# EAGLE schematic EMG (EAGLE 9.3.1)

## Sheet 1 of 2
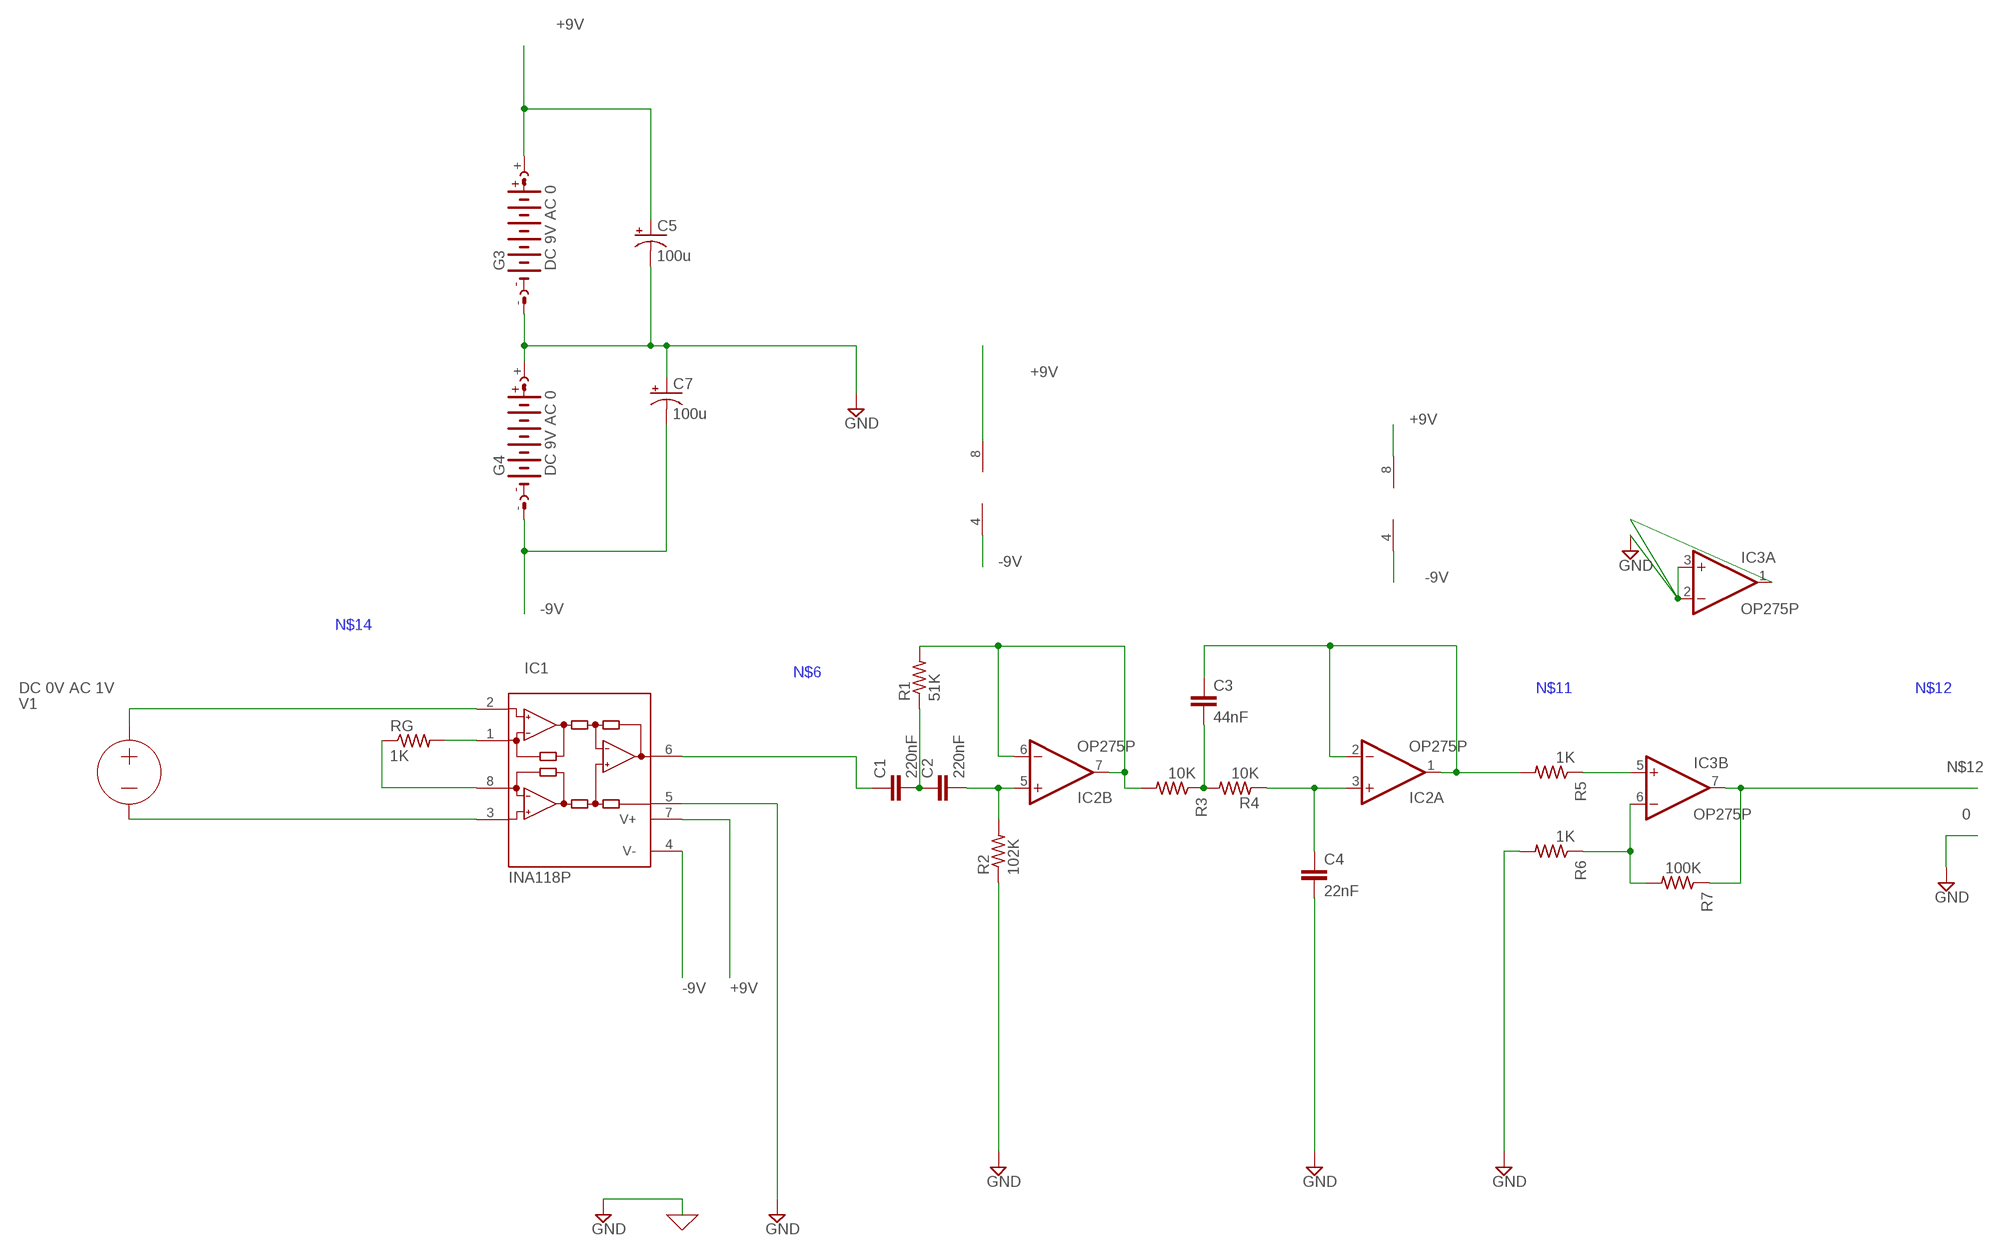
[diagram p0: schematic, sheet 1]

### Parts
C1  220nF  C-EU050-035X075  [C050-035X075]
C2  220nF  C-EU050-035X075  [C050-035X075]
C3  44nF  C-EU050-035X075  [C050-035X075]
C4  22nF  C-EU050-035X075  [C050-035X075]
C5  100u  CPOL-USE2.5-6  [E2,5-6]
C7  100u  CPOL-USE2.5-6  [E2,5-6]
G3  DC 9V AC 0  AB9V  [AB9V]
G4  DC 9V AC 0  AB9V  [AB9V]
IC1  INA118P  [DIL08]
IC2  OP275P  [DIL08]
IC3  OP275P  [DIL08]
R1  51K  R-US_0207/7  [0207/7]
R2  102K  R-US_0207/7  [0207/7]
R3  10K  R-US_0207/7  [0207/7]
R4  10K  R-US_0207/7  [0207/7]
R5  1K  R-US_0207/7  [0207/7]
R6  1K  R-US_0207/7  [0207/7]
R7  100K  R-US_0207/7  [0207/7]
RG  1K  R-US_0207/7  [0207/7]
V1  DC 0V AC 1V  VOLTAGE  (no package)

### Nets
0: C4.2 C5.- C7.+ G3.- G4.+ IC1.5(REF) IC3.1(A:OUT) IC3.2(A:-IN) IC3.3(A:+IN) R2.1 R6.2 ; supply symbol labelled GND ; also sheet 2
+9V: C5.+ G3.+ IC1.7(V+) IC2.8(P:V+) IC3.8(P:V+)
-9V: C7.- G4.- IC1.4(V-) IC2.4(P:V-) IC3.4(P:V-)
N$1: IC1.1(RG) RG.2
N$2: IC1.8(RG) RG.1
N$3: IC1.3(+IN) V1.-
N$5: C1.2 C2.1 R1.1
N$6: C1.1 IC1.6(OUT)
N$7: C2.2 IC2.5(B:+IN) R2.2
N$8: IC2.6(B:-IN) IC2.7(B:OUT) R1.2 R3.2
N$9: C3.2 R3.1 R4.2
N$10: C4.1 IC2.3(A:+IN) R4.1
N$11: C3.1 IC2.1(A:OUT) IC2.2(A:-IN) R5.2
N$12: IC3.7(B:OUT) R7.1 ; also sheet 2
N$14: IC1.2(-IN) V1.+
N$17: IC3.6(B:-IN) R6.1 R7.2
N$18: IC3.5(B:+IN) R5.1

## Sheet 2 of 2
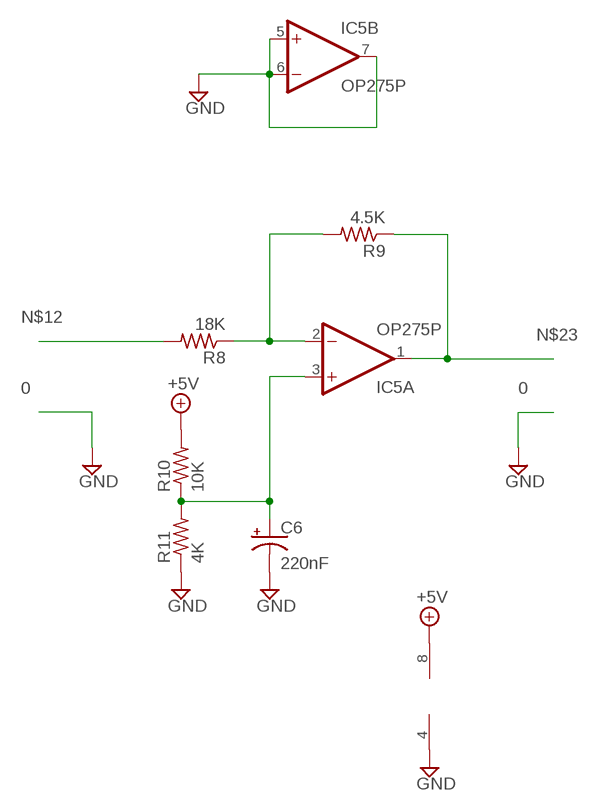
[diagram p1: schematic, sheet 2]

### Parts
C6  220nF  CPOL-USE3.5-10  [E3,5-10]
IC5  OP275P  [DIL08]
R8  18K  R-US_0207/7  [0207/7]
R9  4.5K  R-US_0207/7  [0207/7]
R10  10K  R-US_0207/7  [0207/7]
R11  4K  R-US_0207/7  [0207/7]

### Nets
0: C6.- IC5.4(P:V-) IC5.5(B:+IN) IC5.6(B:-IN) IC5.7(B:OUT) R11.1 ; supply symbol labelled GND ; also sheet 1
+5V: IC5.8(P:V+) R10.2
N$12: R8.2 ; also sheet 1
N$20: C6.+ IC5.3(A:+IN) R10.1 R11.2
N$21: IC5.2(A:-IN) R8.1 R9.2
N$23: IC5.1(A:OUT) R9.1

## Library data of the parts
C1-C4 = rcl:C-EU: CAPACITOR, European symbol; SPICEPREFIX: C
C5-C7 = rcl:CPOL-US: POLARIZED CAPACITOR, American symbol; SPICEPREFIX: C
G3 G4 = battery:AB9V: 9-V BATTERY CLIP; SPICEPREFIX: V
IC1 = burr-brown:INA118: Instrumentation Amplifier Precision, Low Power; MF: TEXAS INSTRUMENTS; MPN: INA118P; OC_FARNELL: 1470354; OC_NEWARK: 96K4515; SPICEMODEL: INA118a; SPICEPREFIX: X
IC2 IC3 IC5 = linear:OP275: Dual Very Low Noise Precision Operational Amplifier Source: http://www.analog.com/static/imported-files/data_sheets/OP270.pdf; SPICEMODEL: OP275p; SPICEPREFIX: X
R1-R11 RG = rcl:R-US_: RESISTOR, American symbol; SPICEPREFIX: R
V1 = ngspice-simulation:VOLTAGE: Independent Voltage Source, either DC, AC, PULSE, SINE, PWL, EXP, or SFFM; SPICEPREFIX: V; VALUE: 0V

## Module MO
Ports: OUT(io) IN(io)

### Library data of the parts